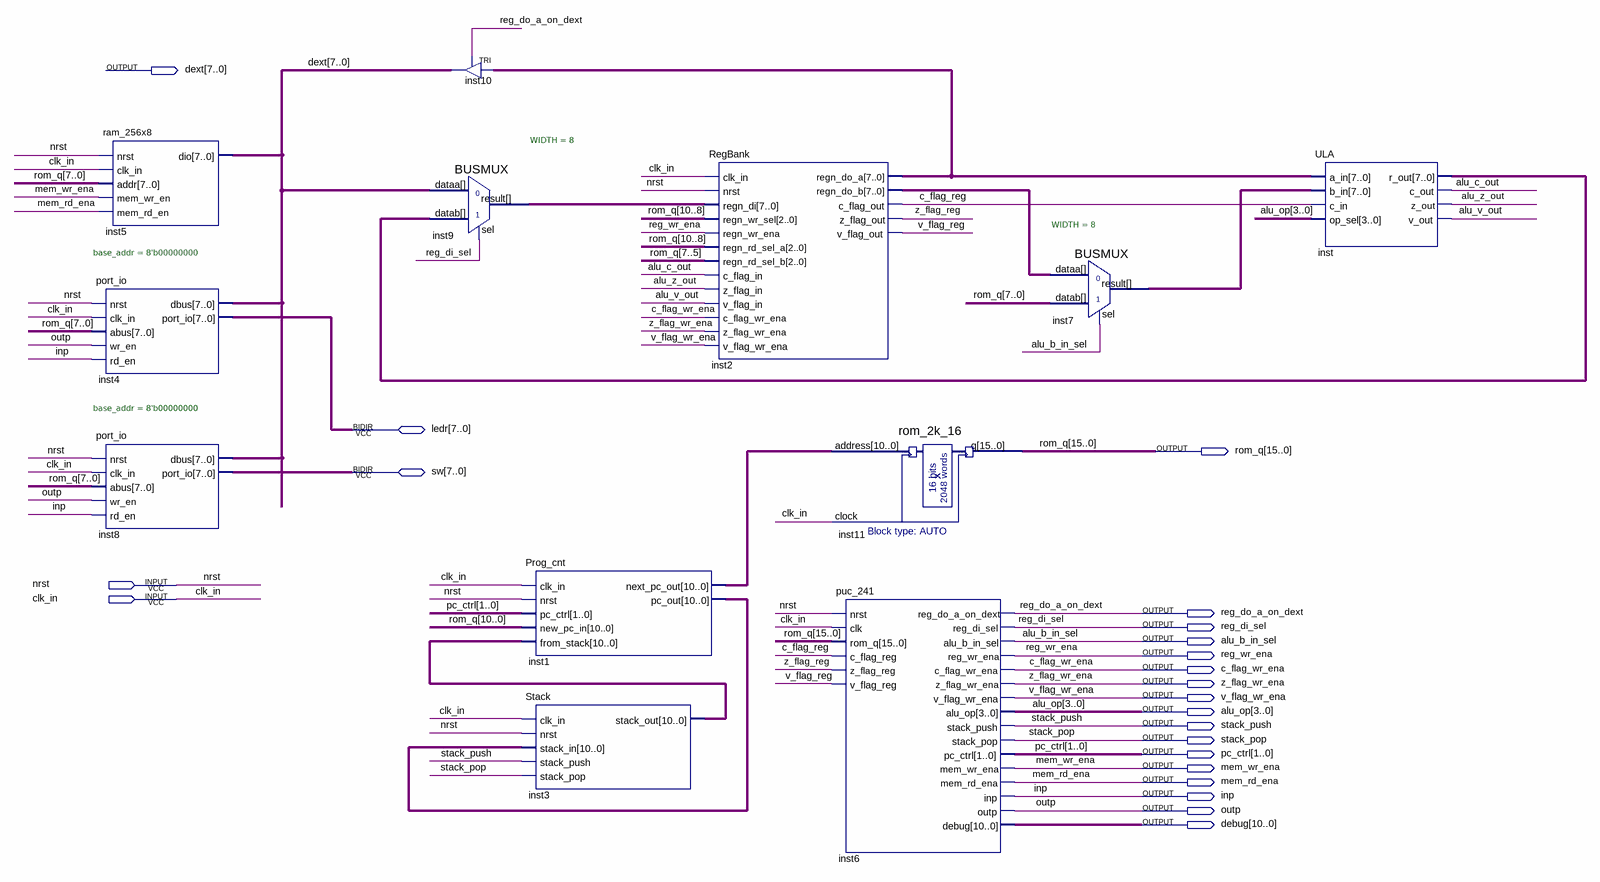
[diagram p0: schematic sheet]
// Quartus schematic puc_241_esquema.bdf as structural Verilog: 12 symbols, 22 pins
module puc_241_esquema (
  input  nrst,
  input  clk_in,
  inout  [7:0] ledr,
  inout  [7:0] sw,
  output [7:0] dext,
  output [15:0] rom_q,
  output reg_do_a_on_dext,
  output reg_di_sel,
  output alu_b_in_sel,
  output reg_wr_ena,
  output c_flag_wr_ena,
  output z_flag_wr_ena,
  output v_flag_wr_ena,
  output [3:0] alu_op,
  output stack_push,
  output stack_pop,
  output [1:0] pc_ctrl,
  output mem_wr_ena,
  output mem_rd_ena,
  output inp,
  output outp,
  output [10:0] debug
);

  wire alu_c_out, alu_v_out, alu_z_out, c_flag_reg, v_flag_reg, z_flag_reg;
  wire [7:0] inst2_regn_do_a, inst2_regn_do_b, inst7_result, inst9_result, inst_r_out;
  wire [10:0] inst1_next_pc_out, inst1_pc_out, inst3_stack_out;

  ram_256x8 inst5 (
    .nrst(nrst), .clk_in(clk_in), .addr(rom_q[7:0]), .mem_wr_en(mem_wr_ena), .mem_rd_en(mem_rd_ena),
    .dio(dext));
  port_io #(.base_addr(8'b00000000)) inst4 (
    .nrst(nrst), .clk_in(clk_in), .abus(rom_q[7:0]), .wr_en(outp), .rd_en(inp), .dbus(dext), .port_io(ledr));
  port_io #(.base_addr(8'b00000000)) inst8 (
    .nrst(nrst), .clk_in(clk_in), .abus(rom_q[7:0]), .wr_en(outp), .rd_en(inp), .dbus(dext), .port_io(sw));
  TRI inst10[7:0] (.IN(inst2_regn_do_a), .OE(reg_do_a_on_dext), .OUT(dext));
  BUSMUX #(.WIDTH(8)) inst9 (.datab(inst_r_out), .sel(reg_di_sel), .dataa(dext), .result(inst9_result));
  Prog_cnt inst1 (
    .clk_in(clk_in), .nrst(nrst), .pc_ctrl(pc_ctrl), .new_pc_in(rom_q[10:0]), .from_stack(inst3_stack_out),
    .next_pc_out(inst1_next_pc_out), .pc_out(inst1_pc_out));
  Stack inst3 (
    .clk_in(clk_in), .nrst(nrst), .stack_in(inst1_pc_out), .stack_push(stack_push), .stack_pop(stack_pop),
    .stack_out(inst3_stack_out));
  RegBank inst2 (
    .clk_in(clk_in), .nrst(nrst), .regn_di(inst9_result), .regn_wr_sel(rom_q[10:8]),
    .regn_wr_ena(reg_wr_ena), .regn_rd_sel_a(rom_q[10:8]), .regn_rd_sel_b(rom_q[7:5]), .c_flag_in(alu_c_out),
    .z_flag_in(alu_z_out), .v_flag_in(alu_v_out), .c_flag_wr_ena(c_flag_wr_ena),
    .z_flag_wr_ena(z_flag_wr_ena), .v_flag_wr_ena(v_flag_wr_ena), .regn_do_a(inst2_regn_do_a),
    .regn_do_b(inst2_regn_do_b), .c_flag_out(c_flag_reg), .z_flag_out(z_flag_reg), .v_flag_out(v_flag_reg));
  rom_2k_16 inst11 (.address(inst1_next_pc_out), .clock(clk_in), .q(rom_q));
  puc_241 inst6 (
    .nrst(nrst), .clk(clk_in), .rom_q(rom_q), .c_flag_reg(c_flag_reg), .z_flag_reg(z_flag_reg),
    .v_flag_reg(v_flag_reg), .reg_do_a_on_dext(reg_do_a_on_dext), .reg_di_sel(reg_di_sel),
    .alu_b_in_sel(alu_b_in_sel), .reg_wr_ena(reg_wr_ena), .c_flag_wr_ena(c_flag_wr_ena),
    .z_flag_wr_ena(z_flag_wr_ena), .v_flag_wr_ena(v_flag_wr_ena), .alu_op(alu_op), .stack_push(stack_push),
    .stack_pop(stack_pop), .pc_ctrl(pc_ctrl), .mem_wr_ena(mem_wr_ena), .mem_rd_ena(mem_rd_ena), .inp(inp),
    .outp(outp), .debug(debug));
  BUSMUX #(.WIDTH(8)) inst7 (.datab(rom_q[7:0]), .sel(alu_b_in_sel), .dataa(inst2_regn_do_b), .result(inst7_result));
  ULA inst (
    .a_in(inst2_regn_do_a), .b_in(inst7_result), .c_in(c_flag_reg), .op_sel(alu_op), .r_out(inst_r_out),
    .c_out(alu_c_out), .z_out(alu_z_out), .v_out(alu_v_out));
endmodule
